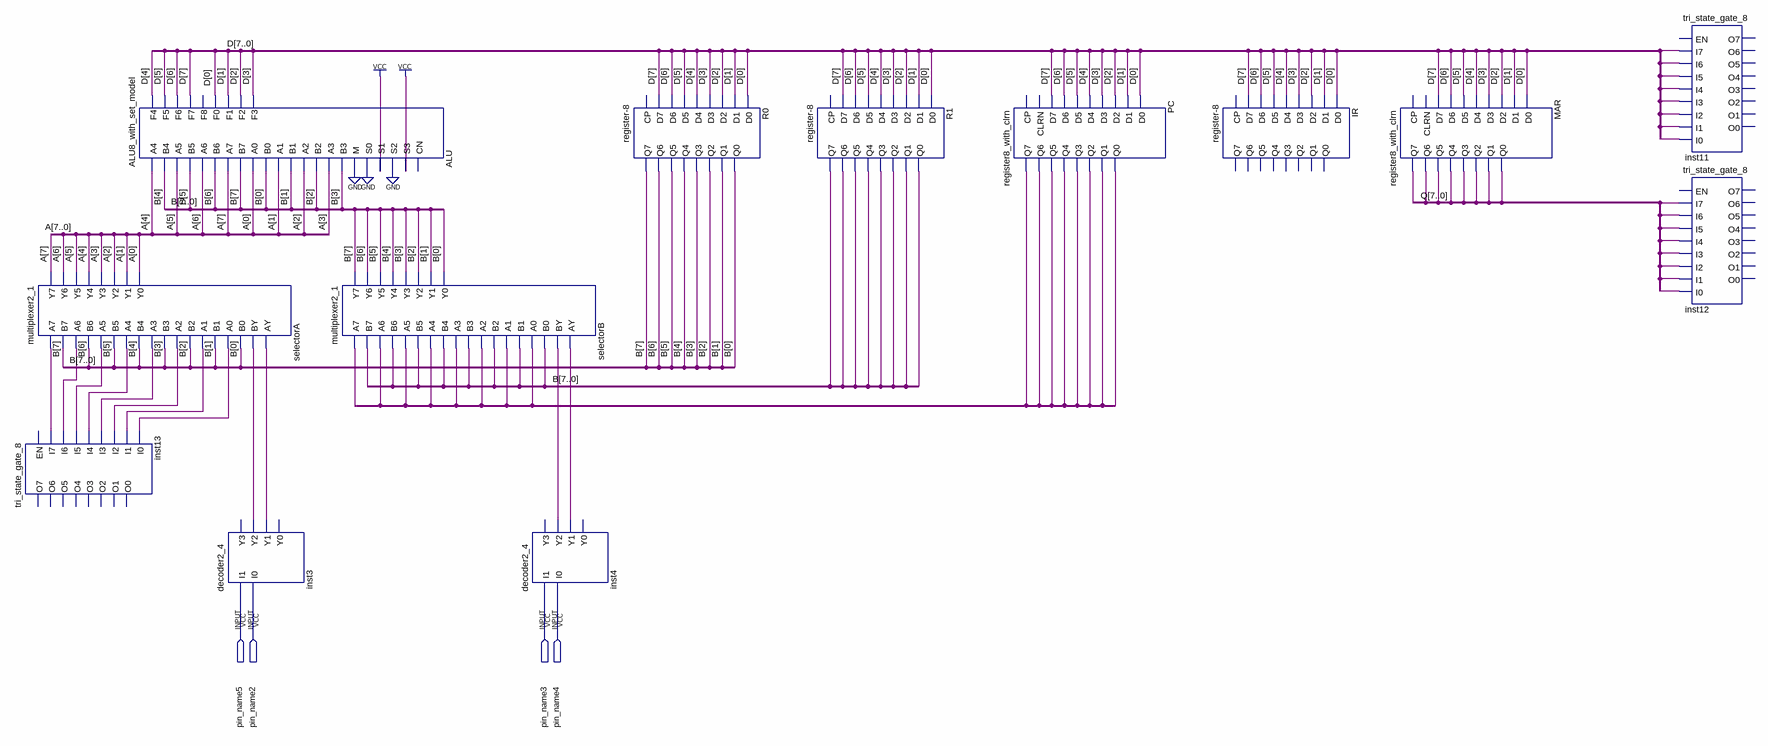
[diagram p0: schematic sheet]
// Quartus schematic model_machine.bdf as structural Verilog: 13 symbols, 4 pins
module model_machine (
  input  pin_name5,
  input  pin_name2,
  input  pin_name3,
  input  pin_name4
);

  wire inst3_y1, inst3_y2, inst4_y1, inst4_y2, MAR_q0, MAR_q1, MAR_q2, MAR_q3, MAR_q4, MAR_q5, MAR_q6,
       MAR_q7, PC_q7, R1_q0, R1_q1, R1_q2, R1_q3, R1_q4, R1_q5, R1_q6, R1_q7, undriven, undriven_2,
       undriven_3, undriven_4, undriven_5, undriven_6, undriven_7, undriven_8, undriven_9, undriven_10,
       undriven_11, undriven_12, undriven_13, undriven_14, undriven_15, undriven_16, undriven_17,
       undriven_18, undriven_19, undriven_20, undriven_21, undriven_22, undriven_23, undriven_24,
       undriven_25, undriven_26, undriven_27, undriven_28, undriven_29, undriven_30, undriven_31, undriven_32;
  wire [7:0] A, B, D;

  multiplexer2_1 selectorA (
    .A7(undriven_27), .B7(B[7]), .A6(undriven_25), .B6(B[6]), .A5(undriven_26), .B5(B[5]), .A4(undriven_28),
    .B4(B[4]), .A3(undriven_29), .B3(B[3]), .A2(undriven_30), .B2(B[2]), .A1(undriven_31), .B1(B[1]),
    .A0(undriven_32), .B0(B[0]), .BY(inst3_y2), .AY(inst3_y1), .Y7(A[7]), .Y6(A[6]), .Y5(A[5]), .Y4(A[4]),
    .Y3(A[3]), .Y2(A[2]), .Y1(A[1]), .Y0(A[0]));
  tri_state_gate_8 inst13 (
    .I7(undriven_27), .I6(undriven_25), .I5(undriven_26), .I4(undriven_28), .I3(undriven_29),
    .I2(undriven_30), .I1(undriven_31), .I0(undriven_32));  // open: EN, O7, O6, O5, O4, O3, O2, O1, O0
  ALU8_with_set_model ALU (
    .A4(A[4]), .B4(B[4]), .A5(A[5]), .B5(B[5]), .A6(A[6]), .B6(B[6]), .A7(A[7]), .B7(B[7]), .A0(A[0]),
    .B0(B[0]), .A1(A[1]), .B1(B[1]), .A2(A[2]), .B2(B[2]), .A3(A[3]), .B3(B[3]), .M(1'b0), .S0(1'b0),
    .S1(1'b1), .S2(1'b0), .S3(1'b1), .F4(D[4]), .F5(D[5]), .F6(D[6]), .F7(D[7]), .F0(D[0]), .F1(D[1]),
    .F2(D[2]), .F3(D[3]));  // open: CN, F8
  decoder2_4 inst3 (.I1(pin_name5), .I0(pin_name2), .Y2(inst3_y2), .Y1(inst3_y1));  // open: Y3, Y0
  multiplexer2_1 selectorB (
    .A7(PC_q7), .B7(undriven), .A6(PC_q7), .B6(undriven_2), .A5(PC_q7), .B5(undriven_3), .A4(PC_q7),
    .B4(undriven_4), .A3(PC_q7), .B3(undriven_5), .A2(PC_q7), .B2(undriven_6), .A1(PC_q7), .B1(undriven_7),
    .A0(PC_q7), .B0(undriven_8), .BY(inst4_y2), .AY(inst4_y1), .Y7(B[7]), .Y6(B[6]), .Y5(B[5]), .Y4(B[4]),
    .Y3(B[3]), .Y2(B[2]), .Y1(B[1]), .Y0(B[0]));
  decoder2_4 inst4 (.I1(pin_name3), .I0(pin_name4), .Y2(inst4_y2), .Y1(inst4_y1));  // open: Y3, Y0
  \register-8  R0 (
    .D7(D[7]), .D6(D[6]), .D5(D[5]), .D4(D[4]), .D3(D[3]), .D2(D[2]), .D1(D[1]), .D0(D[0]), .Q7(B[7]),
    .Q6(B[6]), .Q5(B[5]), .Q4(B[4]), .Q3(B[3]), .Q2(B[2]), .Q1(B[1]), .Q0(B[0]));  // open: CP
  \register-8  R1 (
    .D7(D[7]), .D6(D[6]), .D5(D[5]), .D4(D[4]), .D3(D[3]), .D2(D[2]), .D1(D[1]), .D0(D[0]), .Q7(R1_q7),
    .Q6(R1_q6), .Q5(R1_q5), .Q4(R1_q4), .Q3(R1_q3), .Q2(R1_q2), .Q1(R1_q1), .Q0(R1_q0));  // open: CP
  register8_with_clrn PC (
    .D7(D[7]), .D6(D[6]), .D5(D[5]), .D4(D[4]), .D3(D[3]), .D2(D[2]), .D1(D[1]), .D0(D[0]), .Q7(PC_q7),
    .Q6(PC_q7), .Q5(PC_q7), .Q4(PC_q7), .Q3(PC_q7), .Q2(PC_q7), .Q1(PC_q7), .Q0(PC_q7));  // open: CP, CLRN
  \register-8  IR (
    .D7(D[7]), .D6(D[6]), .D5(D[5]), .D4(D[4]), .D3(D[3]), .D2(D[2]), .D1(D[1]), .D0(D[0]));  // open: CP, Q7, Q6, Q5, Q4, Q3, Q2, Q1, Q0
  register8_with_clrn MAR (
    .D7(D[7]), .D6(D[6]), .D5(D[5]), .D4(D[4]), .D3(D[3]), .D2(D[2]), .D1(D[1]), .D0(D[0]), .Q7(MAR_q7),
    .Q6(MAR_q6), .Q5(MAR_q5), .Q4(MAR_q4), .Q3(MAR_q3), .Q2(MAR_q2), .Q1(MAR_q1), .Q0(MAR_q0));  // open: CP, CLRN
  tri_state_gate_8 inst11 (
    .I7(undriven_9), .I6(undriven_10), .I5(undriven_11), .I4(undriven_12), .I3(undriven_13),
    .I2(undriven_14), .I1(undriven_15), .I0(undriven_16));  // open: EN, O7, O6, O5, O4, O3, O2, O1, O0
  tri_state_gate_8 inst12 (
    .I7(undriven_17), .I6(undriven_18), .I5(undriven_19), .I4(undriven_20), .I3(undriven_21),
    .I2(undriven_22), .I1(undriven_23), .I0(undriven_24));  // open: EN, O7, O6, O5, O4, O3, O2, O1, O0
endmodule
